# EasyEDA Pro project PCB.epro

# Schematic Schematic1_1
Board Name: Board1; Create Date: 2026-04-23; Page Name: P1; Project Name: USB Hub; Schematic Name: Schematic1; Update Date: 2026-04-30; Company: EasyEDA.com; Page Size: A4; Version: V1.0
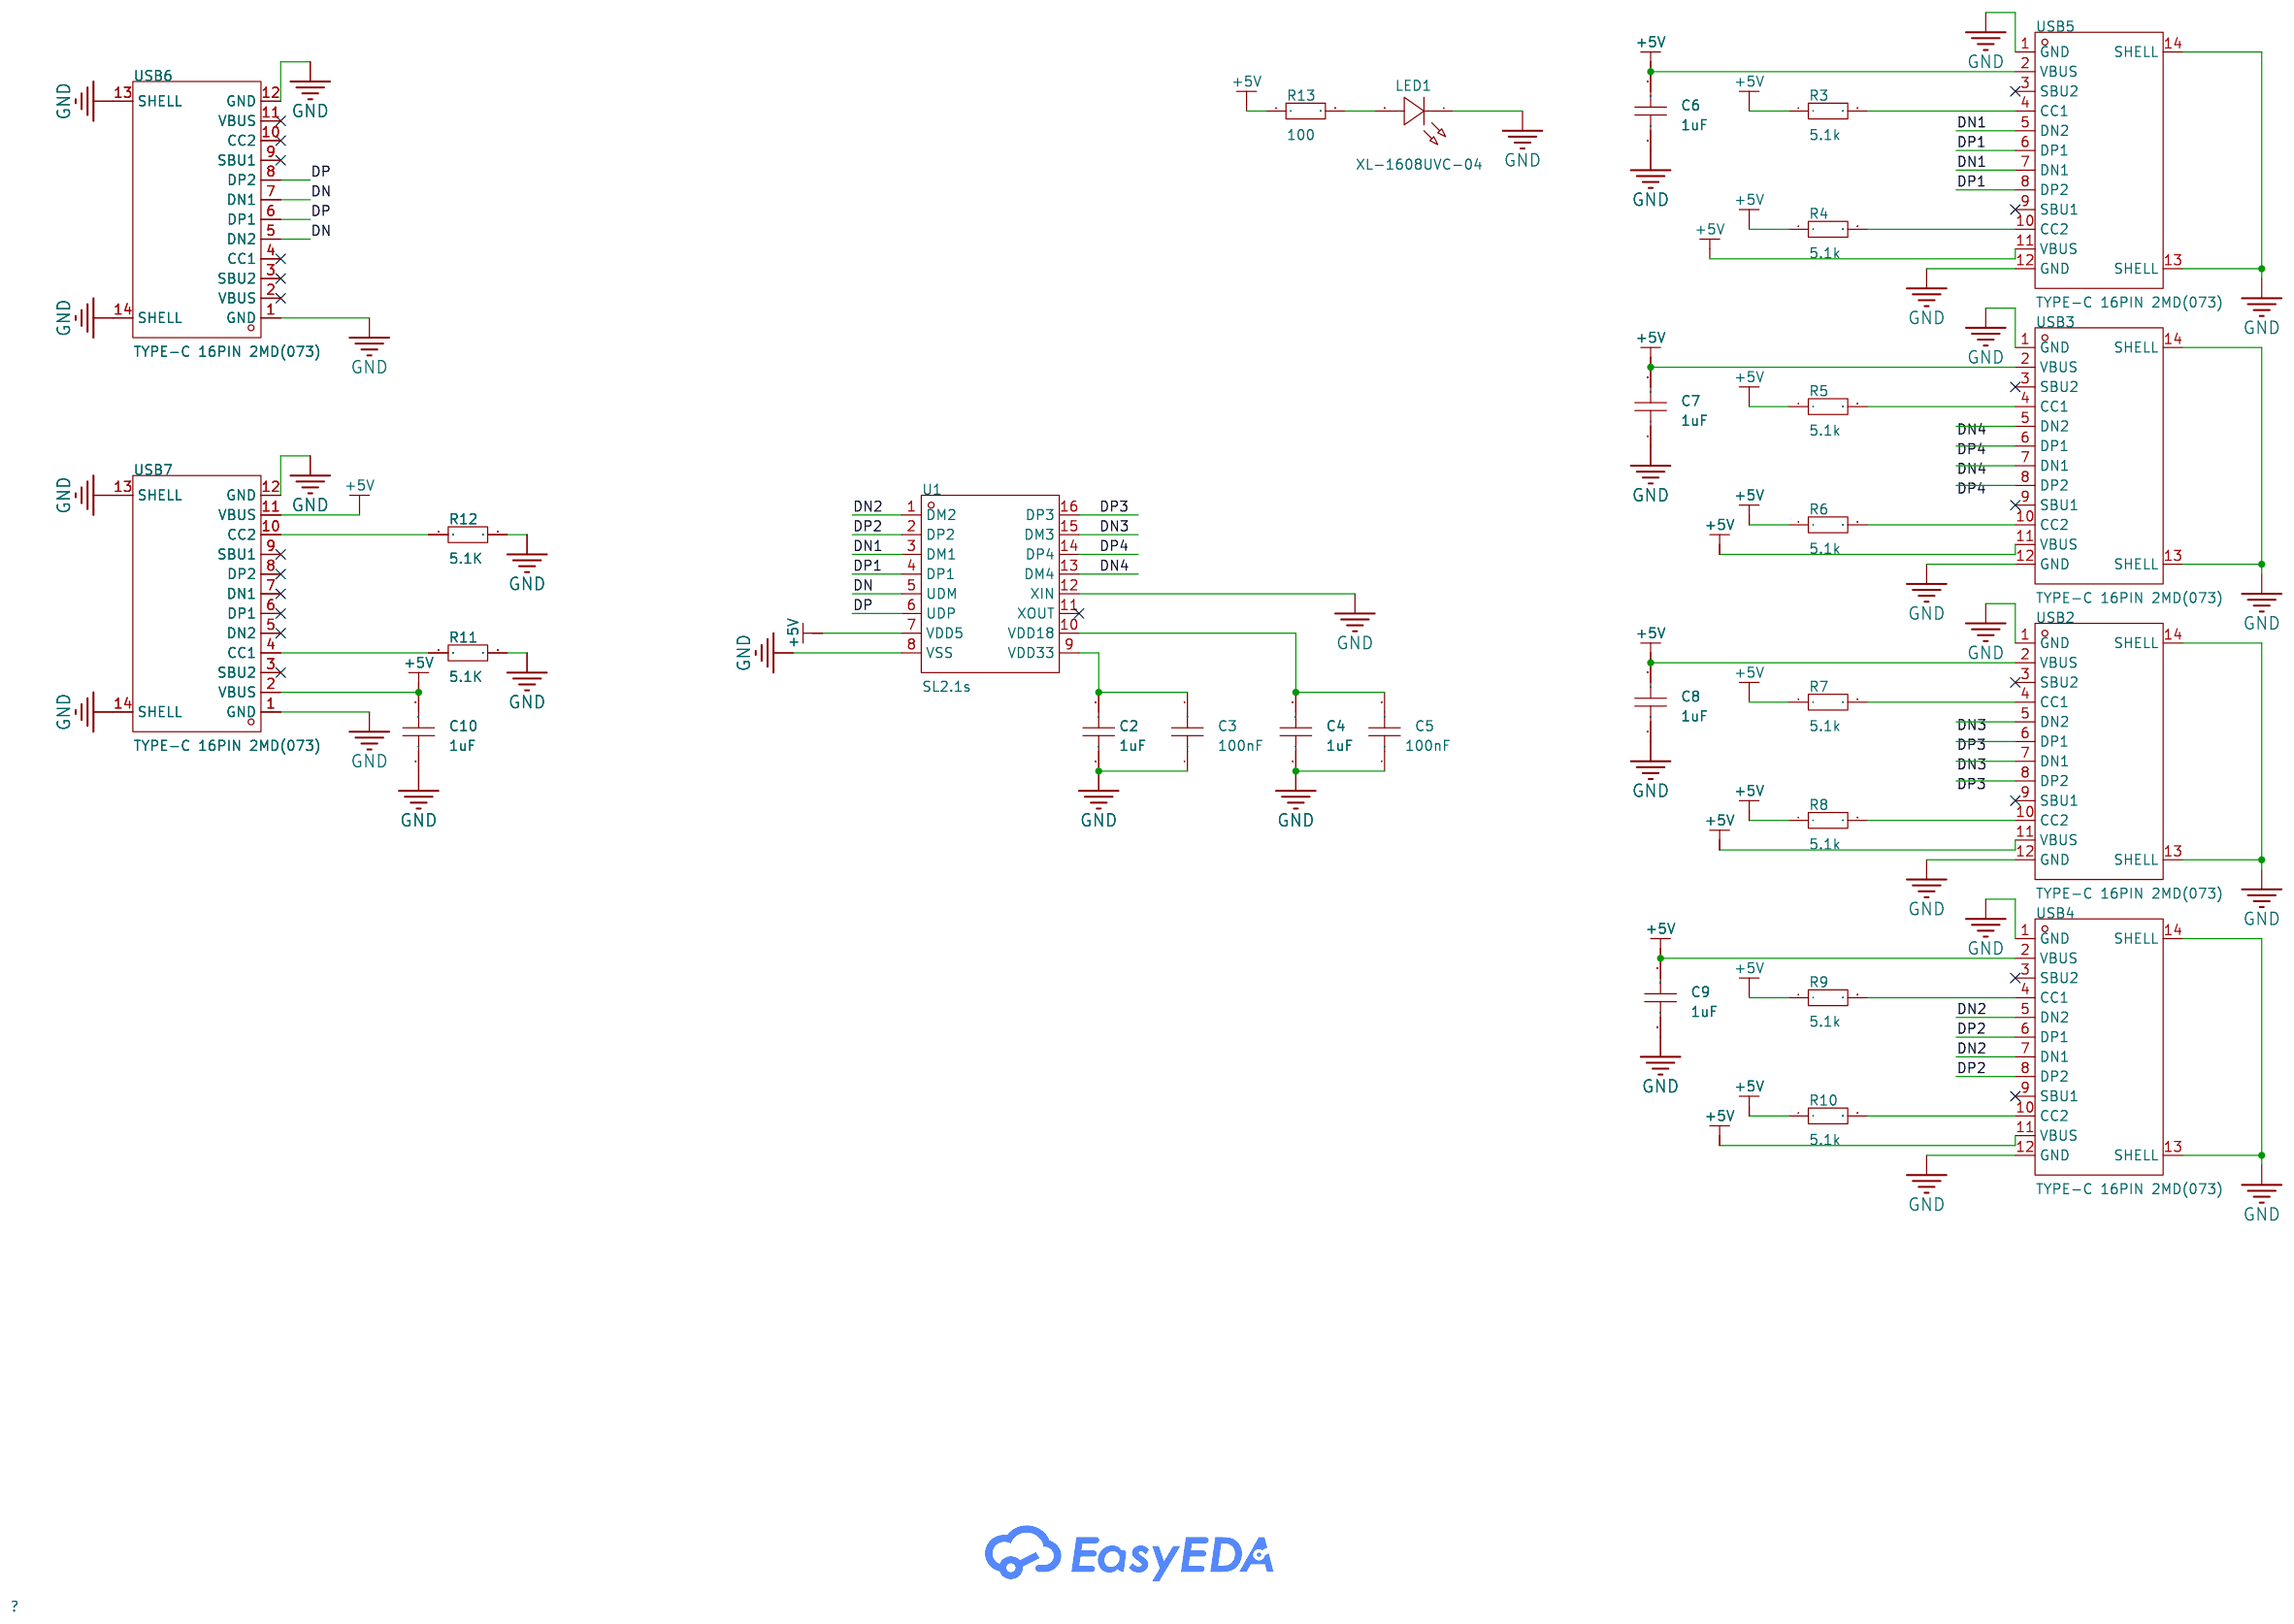
[diagram p0: schematic sheet]

## Parts
C2  1uF  [C0603]
C3  100nF  [C0603]
C4  1uF  [C0603]
C5  100nF  [C0603]
C6  1uF  [C0603]
C7  1uF  [C0603]
C8  1uF  [C0603]
C9  1uF  [C0603]
C10  1uF  [C0603]
LED1  XL-1608UVC-04  [LED0603-RD_PINK]
R3  5.1k  [R0603]
R4  5.1k  [R0603]
R5  5.1k  [R0603]
R6  5.1k  [R0603]
R7  5.1k  [R0603]
R8  5.1k  [R0603]
R9  5.1k  [R0603]
R10  5.1k  [R0603]
R11  10K  [R0603]
R12  10K  [R0603]
R13  100  [R0603]
U1  SL2.1s  [SSOP-16_L4.6-W2.6-P0.53-LS4.0-BL]
USB2  TYPE-C 16PIN 2MD(073)  [USB-C-SMD_TYPE-C-6PIN-2MD-073]
USB3  TYPE-C 16PIN 2MD(073)  [USB-C-SMD_TYPE-C-6PIN-2MD-073]
USB4  TYPE-C 16PIN 2MD(073)  [USB-C-SMD_TYPE-C-6PIN-2MD-073]
USB5  TYPE-C 16PIN 2MD(073)  [USB-C-SMD_TYPE-C-6PIN-2MD-073]
USB6  TYPE-C 16PIN 2MD(073)  [USB-C-SMD_TYPE-C-6PIN-2MD-073]
USB7  TYPE-C 16PIN 2MD(073)  [USB-C-SMD_TYPE-C-6PIN-2MD-073]

## Library data of the parts
C2-C10 = CAP_0603: Supplier Footprint: 0603
LED1 = XL-1608UVC-04: Lamp Holder Type:- Illumination Color:Purple Voltage - Forward(Vf):3.4V Voltage - Forward(Vf):3.4V Power(Watts):100mW Forward Current:5mA Wavelength - Dominant:390nm~429nm Wavelength - Dominant:390nm~429nm Peak Wavelength:405nm Diode Configuration:Discret; LCSC Part Name: 紫色; Supplier Part: C7371898; Manufacturer: XINGLIGHT(成兴光); Supplier Footprint: 0603; JLCPCB Part Class: Extended Part; Datasheet: https://item.szlcsc.com/datasheet/XL-1608UVC-04/8342970.html; Supplier: LCSC; Illumination Color: Purple; Voltage - Forward(Vf): 3.4V; Power(Watts): 100mW; Forward Current: 5mA; Wavelength - Dominant: 390nm~429nm; Peak Wavelength: 405nm; Diode Configuration: Discrete Diode; Lens Color: Water Clear; Luminous Intensity: 60mcd; Viewing Angle: 120°; Mounting Style: Top-mount; Operating Temperature: -40℃~+85℃
R3-R13 = Res_0603: Supplier Footprint: 0603
U1 = SL2.1s: type:Hub USB Protocol:USB 2.0 Data Rate:- Voltage - Supply:4V~5.25V Voltage - Supply:4V~5.25V Operating Temperature:0℃~+70℃ Operating Temperature:0℃~+70℃ Memory Interface:- Current - Supply:120mA Quiescent Supply Current:2.5mA Number of Channels:4; LCSC Part Name: USB2.0 HUB控制器集成电路; Supplier Part: C2684433; Manufacturer: CoreChips(和芯润德); Supplier Footprint: SSOP-16; JLCPCB Part Class: Extended Part; Datasheet: https://item.szlcsc.com/datasheet/SL2.1s/2782346.html; Supplier: LCSC; type: Hub; USB Protocol: USB 2.0; Voltage - Supply: 4V~5.25V; Operating Temperature: 0℃~+70℃; Current - Supply: 120mA; Quiescent Supply Current: 2.5mA; Number of Channels: 4
USB2-USB7 = TYPE-C 16PIN 2MD(073): Connector Type:Type-C Protocol Standard:- Gender:Female Mounting Type:Surface Mount, Right Angle Number of Contacts:16P Number of Ports:1 Current Rating-Power:3A Voltage Rating:5V Connect-Disconnect Life:10,000 Cycles Supplementary Features:- Center Heigh; LCSC Part Name: Type-C 母 卧贴; Supplier Part: C2765186; Manufacturer: SHOU HAN(首韩); Supplier Footprint: SMD; JLCPCB Part Class: Extended Part; Datasheet: https://item.szlcsc.com/datasheet/TYPE-C%252016PIN%25202MD(073)/2901843.html; Supplier: LCSC; Connector Type: Type-C; Gender: Female; Mounting Type: Surface Mount, Right Angle; Number of Contacts: 16P; Number of Ports: 1; Current Rating-Power: 3A; Voltage Rating: 5V; Connect-Disconnect Life: 10,000 Cycles; Detection color: Black; Operating Temperature: -25℃~+85℃

## Nets
+5V: C6.2 C7.2 C8.2 C9.2 C10.2 R3.1 R4.1 R5.1 R6.1 R7.1 R8.1 R9.1 R10.1 R13.1 U1.7(VDD5) USB2.2(VBUS) USB2.11(VBUS) USB3.2(VBUS) USB3.11(VBUS) USB4.2(VBUS) USB4.11(VBUS) USB5.2(VBUS) USB5.11(VBUS) USB7.2(VBUS) USB7.11(VBUS)
GND: C2.1 C3.1 C4.1 C5.1 C6.1 C7.1 C8.1 C9.1 C10.1 LED1.1(K) R11.2 R12.2 U1.8(VSS) U1.12(XIN) USB2.1(GND) USB2.12(GND) USB2.13(SHELL) USB2.14(SHELL) USB3.1(GND) USB3.12(GND) USB3.13(SHELL) USB3.14(SHELL) USB4.1(GND) USB4.12(GND) USB4.13(SHELL) USB4.14(SHELL) USB5.1(GND) USB5.12(GND) USB5.13(SHELL) USB5.14(SHELL) USB6.1(GND) USB6.12(GND) USB6.13(SHELL) USB6.14(SHELL) USB7.1(GND) USB7.12(GND) USB7.13(SHELL) USB7.14(SHELL)
DN: U1.5(UDM) USB6.5(DN2) USB6.7(DN1)
DN1: U1.3(DM1) USB5.5(DN2) USB5.7(DN1)
DN2: U1.1(DM2) USB4.5(DN2) USB4.7(DN1)
DN3: U1.15(DM3) USB2.5(DN2) USB2.7(DN1)
DN4: U1.13(DM4) USB3.5(DN2) USB3.7(DN1)
DP: U1.6(UDP) USB6.6(DP1) USB6.8(DP2)
DP1: U1.4(DP1) USB5.6(DP1) USB5.8(DP2)
DP2: U1.2(DP2) USB4.6(DP1) USB4.8(DP2)
DP3: U1.16(DP3) USB2.6(DP1) USB2.8(DP2)
DP4: U1.14(DP4) USB3.6(DP1) USB3.8(DP2)
$1N2501: R3.2 USB5.4(CC1)
$1N2505: R4.2 USB5.10(CC2)
$1N2510: R5.2 USB3.4(CC1)
$1N2521: R6.2 USB3.10(CC2)
$1N2525: R7.2 USB2.4(CC1)
$1N2530: R8.2 USB2.10(CC2)
$1N2535: R9.2 USB4.4(CC1)
$1N2540: R10.2 USB4.10(CC2)
$1N2933: C2.2 C3.2 U1.9(VDD33)
$1N2952: C4.2 C5.2 U1.10(VDD18)
$1N3496: R12.1 USB7.10(CC2)
$1N3510: R11.1 USB7.4(CC1)
$1N5105: LED1.2(A) R13.2

Not connected (* = marked no-connect by the designer): U1 11(XOUT)*; USB2 3(SBU2)* 9(SBU1)*; USB3 3(SBU2)* 9(SBU1)*; USB4 3(SBU2)* 9(SBU1)*; USB5 3(SBU2)* 9(SBU1)*; USB6 2(VBUS)* 3(SBU2)* 4(CC1)* 9(SBU1)* 10(CC2)* 11(VBUS)*; USB7 3(SBU2)* 5(DN2)* 6(DP1)* 7(DN1)* 8(DP2)* 9(SBU1)*

# Board PCB1_1
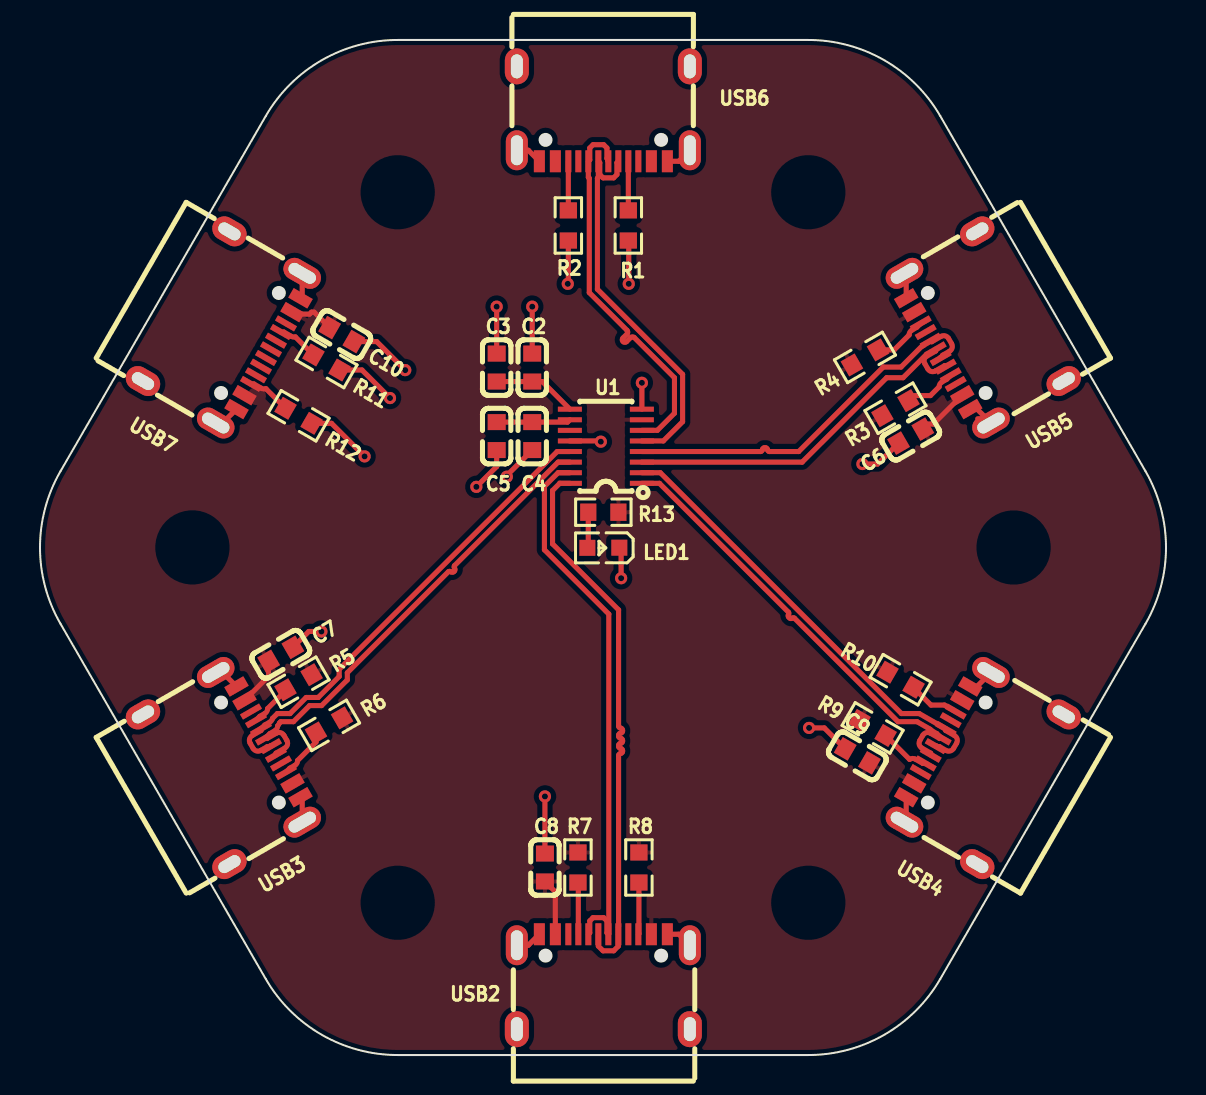
[diagram p1: board, top side]
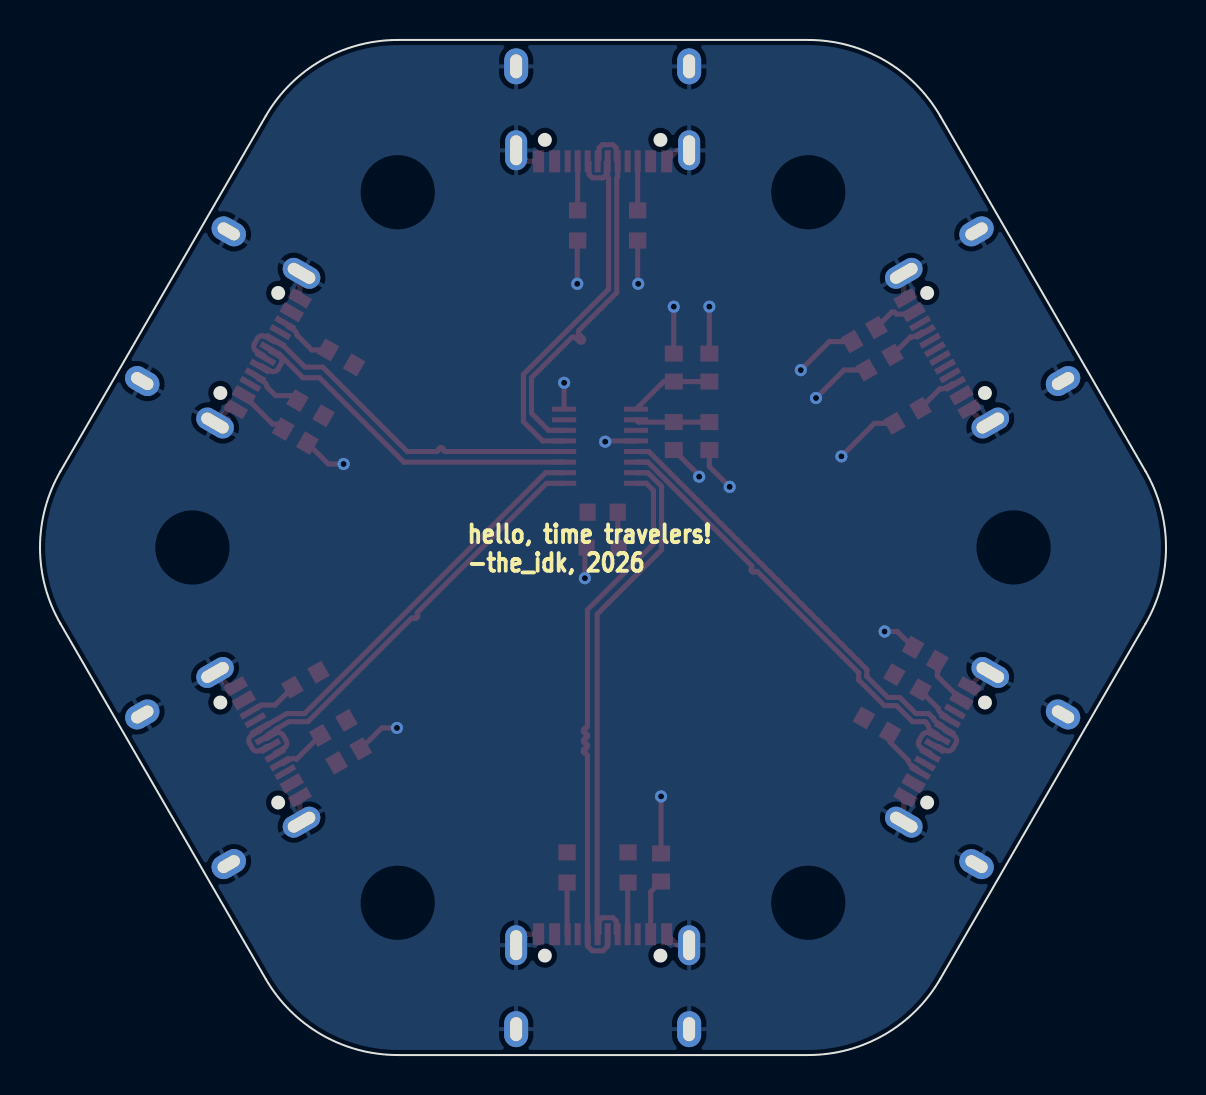
[diagram p2: board, bottom side, seen from below]

Outline 56.3 x 50.8 mm; copper layers: Top Layer, Bottom Layer. Coordinates in mm from the lower left corner of the outline.
Outline path: 1.02,21.59 arc(0,25.4) 1.02,29.21 11.29,46.99 arc(14.08,49.78) 17.89,50.8 38.42,50.8 arc(42.23,49.78) 45.02,46.99 55.28,29.21 arc(56.3,25.4) 55.28,21.59 45.02,3.81 arc(42.23,1.02) 38.42,0 17.89,0 arc(14.08,1.02) 11.29,3.81 1.02,21.59
Stack: Top Layer 0.035mm / Dielectric1 1.51mm FR4 er 4.5 / Bottom Layer 0.035mm

## Design rules (mm)
net DN2: DP2
net DP2: DP2
net DN1: DP1
net DP1: DP1
net DN: DP5
net DP: DP5
net DN4: DP3
net DP4: DP3
net DN3: DP4
net DP3: DP4
template: JLCPCB Capability(Two Layers Board)
spacing copperThickness1oz (default): track to track 0.102, other pairs 0.152 to 0.3
spacing copperThickness2oz: track to track 0.203, other pairs 0.152 to 0.3
track width copperThickness1oz (default): min 0.127, default 0.254, max 2.54
track width copperThickness2oz: min 0.203, default 0.254, max 2.54
differential pair differentialPair (default): width min 0.127, default 0.254, max 2.54; gap min 0.152, default 0.152
via viaSize (default): diameter min 0.5, default 0.61, max 10; hole min 0.3, default 0.305, max 6.3

## Placement (name value [footprint] x y rotation side)
C2  1uF  [C0603]  24.61 34.4 270 top
C3  100nF  [C0603]  22.83 34.4 270 top
C4  1uF  [C0603]  24.61 30.98 90 top
C5  100nF  [C0603]  22.83 30.98 90 top
C6  1uF  [C0603]  43.53 30.98 30 top
C7  1uF  [C0603]  12.04 20.05 210 top
C8  1uF  [C0603]  25.25 9.39 270 top
C9  1uF  [C0603]  40.87 14.97 330 top
C10  1uF  [C0603]  15.09 36.06 150 top
LED1  XL-1608UVC-04  [LED0603-RD_PINK]  28.17 25.39 180 top
R1  -  [R0603]  29.42 41.52 270 top
R2  -  [R0603]  26.42 41.52 270 top
R3  5.1k  [R0603]  42.77 32.37 30 top
R4  5.1k  [R0603]  41.25 34.91 30 top
R5  5.1k  [R0603]  12.93 18.66 210 top
R6  5.1k  [R0603]  14.45 16.5 210 top
R7  5.1k  [R0603]  26.9 9.39 270 top
R8  5.1k  [R0603]  29.95 9.39 270 top
R9  5.1k  [R0603]  41.63 16.37 330 top
R10  5.1k  [R0603]  43.03 18.78 330 top
R11  10K  [R0603]  14.32 34.66 330 top
R12  10K  [R0603]  12.93 31.99 330 top
R13  100  [R0603]  28.17 27.17 180 top
U1  SL2.1s  [SSOP-16_L4.6-W2.6-P0.53-LS4.0-BL]  28.29 30.47 90 top
USB2  TYPE-C 16PIN 2MD(073)  [USB-C-SMD_TYPE-C-6PIN-2MD-073]  28.17 3.67 0 top
USB3  TYPE-C 16PIN 2MD(073)  [USB-C-SMD_TYPE-C-6PIN-2MD-073#2]  9.37 14.49 300 top
USB4  TYPE-C 16PIN 2MD(073)  [USB-C-SMD_TYPE-C-6PIN-2MD-073#3]  46.97 14.49 60 top
USB5  TYPE-C 16PIN 2MD(073)  [USB-C-SMD_TYPE-C-6PIN-2MD-073#2]  46.97 36.29 120 top
USB6  TYPE-C 16PIN 2MD(073)  [USB-C-SMD_TYPE-C-6PIN-2MD-073]  28.17 47.1 180 top
USB7  TYPE-C 16PIN 2MD(073)  [USB-C-SMD_TYPE-C-6PIN-2MD-073#3]  9.37 36.29 240 top

## Footprints (pads in the part's own frame, mm; a bottom-side part is the same pattern mirrored in y, then rotated)
C0603
  rect 0.8x0.9 smd: 1(-0.7,0) 2(0.7,0)
LED0603-RD_PINK
  rect 0.8x0.8 smd: 1(-0.799,-0.004) 2(0.799,0.004)
R0603
  rect 0.806x0.864 smd: 1(-0.753,0) 2(0.753,0)
SSOP-16_L4.6-W2.6-P0.53-LS4.0-BL
  rect 0.25x1.2 smd: 1(-1.855,-1.8) 2(-1.325,-1.8) 3(-0.795,-1.8) 4(-0.265,-1.8) 5(0.265,-1.8) 6(0.795,-1.8) 7(1.325,-1.8) 8(1.855,-1.8) 9(1.855,1.8) 10(1.325,1.8) 11(0.795,1.8) 12(0.265,1.8) 13(-0.265,1.8) 14(-0.795,1.8) 15(-1.325,1.8) 16(-1.855,1.8)
USB-C-SMD_TYPE-C-6PIN-2MD-073
  rect 0.55x1.1 smd: 1(-3.2,2.375) 2(-2.4,2.375) 11(2.4,2.375) 12(3.2,2.375)
  rect 0.3x1.1 smd: 3(-1.75,2.375) 4(-1.25,2.375) 5(-0.75,2.375) 6(-0.25,2.375) 7(0.25,2.375) 8(0.75,2.375) 9(1.25,2.375) 10(1.75,2.375)
  oval 1.1x2 hole 0.6x1.5: 13(-4.325,1.825) 14(4.325,1.825)
  oval 1.2x1.8 hole 0.6x1.2: 13(-4.325,-2.375) 14(4.325,-2.375)
USB-C-SMD_TYPE-C-6PIN-2MD-073#2
  rect 0.55x1.1 smd: 1(-3.2,2.375) 2(-2.4,2.375) 11(2.4,2.375) 12(3.2,2.375)
  rect 0.3x1.1 smd: 3(-1.75,2.375) 4(-1.25,2.375) 5(-0.75,2.375) 6(-0.25,2.375) 7(0.25,2.375) 8(0.75,2.375) 9(1.25,2.375) 10(1.75,2.375)
  oval 1.1x2 hole 0.6x1.5: 13(-4.325,1.825) 14(4.325,1.825)
  oval 1.2x1.8 hole 0.6x1.2: 13(-4.325,-2.375) 14(4.325,-2.375)
USB-C-SMD_TYPE-C-6PIN-2MD-073#3
  rect 0.55x1.1 smd: 1(-3.2,2.375) 2(-2.4,2.375) 11(2.4,2.375) 12(3.2,2.375)
  rect 0.3x1.1 smd: 3(-1.75,2.375) 4(-1.25,2.375) 5(-0.75,2.375) 6(-0.25,2.375) 7(0.25,2.375) 8(0.75,2.375) 9(1.25,2.375) 10(1.75,2.375)
  oval 1.1x2 hole 0.6x1.5: 13(-4.325,1.825) 14(4.325,1.825)
  oval 1.2x1.8 hole 0.6x1.2: 13(-4.325,-2.375) 14(4.325,-2.375)

## Nets
As in the schematic, except:
GND: C2.1 C3.1 C4.1 C5.1 C6.1 C7.1 C8.1 C9.1 C10.1 LED1.1 R1.2 R2.2 R11.2 R12.2 U1.8 U1.12 USB2.1 USB2.12 USB2.13 USB2.14 USB3.1 USB3.12 USB3.13 USB3.14 USB4.1 USB4.12 USB4.13 USB4.14 USB5.1 USB5.12 USB5.13 USB5.14 USB6.1 USB6.12 USB6.13 USB6.14 USB7.1 USB7.12 USB7.13 USB7.14
$1N1157: R2.1 USB6.10
$1N2081: R1.1 USB6.4

Pads without a net: U1 11; USB2 3 9; USB3 3 9; USB4 3 9; USB5 3 9; USB6 2 3 9 11; USB7 3 5 6 7 8 9

## Via types
v1: diameter 0.61, hole 0.305, Top Layer to Bottom Layer, 16 vias

## Routing (per net, layer and track width the routed paths; a pad name or vN(x,y) marks a point on that pad's centre or on a via; arc(x,y) is an arc through that point)
+5V: length 9.9
  Top Layer w0.254: USB5.2 44.67,31.58 44.39,31.58 ; USB3.2 11.43,18.96 C7.2 ; C10.2 13.71,37.18 13.58,37.18 13.48,37.08 12.85,37.08 12.75,37.18 12.62,37.18 ; USB2.2 25.77,8.16 C8.2
GND: length 52.9
  Top Layer w0.254: USB2.12 31.94,6.05 USB2.14 ; C3.1 v1(22.83,37.45) ; C2.1 v1(24.61,37.45) ; U1.8 v1(30.09,33.64) ; USB4.1 43.31,11.74 43.22,11.65 ; v1(28.04,30.7) 28,30.73 U1.12 ; v1(29.06,23.86) 29.06,25.3 LED1.1 ; 13.11,39.12 13.11,37.96 USB7.1 ; 47.5,31.57 47.23,31.84 46.89,31.84 ; v1(14.07,21.2) 13.44,21.2 12.64,20.4 ; USB3.12 13.11,12.82 13.11,11.65 ; USB6.1 31.94,44.73 USB6.13 ; USB5.13 46.85,32.33 46.51,32.33 ; USB4.14 46.85,18.45 46.51,18.45 ; C9.1 39.21,16.37 v1(38.45,16.37) ; R2.2 26.42,38.62 v1(26.39,38.6) ; C5.1 22.83,29.45 v1(21.82,28.44) ; USB6.12 24.42,45.28 USB6.14 ; v1(17.5,32.88) 16.1,34.28 R11.2 ; 9.82,32.33 9.13,31.63 USB7.14 ; C8.1 v1(25.25,12.94) ; USB2.1 24.42,5.5 USB2.13 ; R12.2 14.57,31.61 v1(16.23,29.96) ; USB5.12 43.31,39.03 43.22,39.12 ; USB3.13 9.13,19.15 9.82,18.45 ; C6.1 41.88,29.58 v1(41.12,29.58) ; v1(18.26,34.28) 16.83,35.71 15.69,35.71 ; v1(29.44,38.6) 29.44,40.74 R1.2 ; C4.1 23.34,29.01 v1(23.34,28.94)
DN: length 19.6
  Top Layer w0.254: U1.5 31.17,30.73 32.13,31.7 32.13,34.06 27.87,38.32 27.87,43.88 27.92,43.93 USB6.7 27.99,44.66 27.99,44.06 28.15,43.9 28.68,43.9 28.85,44.06 28.85,44.66 USB6.5
DN1: length 18.9
  Top Layer w0.254: 45.29,34.45 45.23,34.5 44.77,34.24 arc(44.56,34.21) 44.39,34.34 44.24,34.6 arc(44.22,34.81) 44.35,34.98 44.79,35.23 44.79,35.32 ; 44.42,35.07 44.32,35.07 43.15,33.9 42.33,33.9 38.11,29.67 U1.3
DN2: length 22.7
  Top Layer w0.254: U1.1 30.97,28.61 37.43,22.16 arc(37.45,22.1) 37.43,22.04 arc(37.4,21.99) 37.43,21.93 37.49,21.86 arc(37.55,21.84) 37.61,21.86 arc(37.66,21.89) 37.72,21.86 42.9,16.68 43.85,16.68 44.51,16.3 arc(44.55,16.26) 44.6,16.23 44.84,16.08 USB4.7 44.98,15.84 44.52,16.1 arc(44.31,16.13) 44.14,16 43.99,15.74 arc(43.97,15.53) 44.1,15.36 44.54,15.11 USB4.5
DN3: length 27.7
  Top Layer w0.254: U1.15 25.91,29.14 25.22,28.46 25.22,25.29 28.44,22.07 28.44,6.07 USB2.7 28.35,6.12 28.35,6.71 28.18,6.87 27.65,6.87 27.49,6.71 27.49,6.12 USB2.5
DN4: length 23.8
  Top Layer w0.254: 11.55,15.46 11.53,15.48 arc(11.45,15.45) 11.36,15.43 11.04,15.24 arc(10.83,15.22) 10.66,15.35 10.51,15.61 arc(10.48,15.82) 10.61,15.99 11.05,16.24 11.05,16.32 11.24,16.52 11.49,16.66 arc(11.58,16.74) 11.62,16.84 11.87,17.09 12.5,17.09 13.31,17.89 13.91,17.89 14.96,18.94 14.96,19.3 25.86,30.2 U1.13
DP: length 19.6
  Top Layer w0.254: U1.6 30.87,31.26 31.72,32.12 31.72,33.9 29.71,35.91 arc(29.62,35.94) 29.53,35.91 29.33,35.71 arc(29.15,35.71) 29.15,35.89 29.35,36.09 arc(29.39,36.18) 29.35,36.27 27.46,38.16 27.46,43.88 27.42,43.93 USB6.8 27.49,44.8 27.49,45.39 27.65,45.56 28.18,45.56 28.35,45.39 28.35,44.87 28.4,44.83 28.4,44.75 USB6.6
DP1: length 18.8
  Top Layer w0.254: U1.4 36.03,30.2 arc(36.1,30.23) 36.12,30.3 arc(36.15,30.36) 36.21,30.39 36.28,30.39 arc(36.35,30.36) 36.38,30.3 arc(36.4,30.23) 36.47,30.2 37.94,30.2 42.16,34.43 43.05,34.43 44.12,35.5 44.17,35.5 ; USB5.8 44.59,35.7 45.05,35.96 arc(45.26,35.99) 45.43,35.86 45.58,35.6 arc(45.61,35.39) 45.48,35.22 45.13,35.02 arc(45.09,34.96) 45.04,34.91 USB5.6
DP2: length 22.7
  Top Layer w0.254: 44.79,15.46 44.8,15.48 arc(44.89,15.45) 44.97,15.43 45.3,15.24 arc(45.51,15.22) 45.68,15.35 45.83,15.61 arc(45.86,15.82) 45.73,15.99 45.29,16.24 45.29,16.32 43.96,17.09 43.07,17.09 31.02,29.14 U1.2
DP3: length 27.7
  Top Layer w0.254: USB2.6 27.92,5.45 28.15,5.22 28.68,5.22 28.92,5.45 USB2.8 28.92,6.4 28.93,6.42 28.93,14.99 arc(28.96,15.06) 29.03,15.09 arc(29.1,15.12) 29.13,15.19 29.13,15.25 arc(29.1,15.32) 29.03,15.35 arc(28.96,15.37) 28.93,15.45 28.93,15.5 arc(28.96,15.57) 29.03,15.6 arc(29.1,15.63) 29.13,15.7 29.13,15.75 arc(29.1,15.82) 29.03,15.85 arc(28.96,15.88) 28.93,15.95 28.93,16.01 arc(28.96,16.08) 29.03,16.11 arc(29.1,16.14) 29.13,16.21 29.13,16.26 arc(29.1,16.33) 29.03,16.36 arc(28.96,16.39) 28.93,16.46 28.93,22.28 25.63,25.58 25.63,28.25 25.99,28.61 U1.16
DP4: length 23.8
  Top Layer w0.254: USB3.8 11.8,15.11 12.24,15.36 arc(12.37,15.53) 12.34,15.74 12.19,16 arc(12.02,16.13) 11.81,16.1 11.35,15.84 USB3.6 11.49,16.08 11.74,16.23 arc(11.84,16.33) 11.88,16.47 arc(11.93,16.54) 11.98,16.62 12.04,16.68 12.67,16.68 13.48,17.49 14.08,17.49 15.37,18.77 15.37,19.13 20.42,24.18 arc(20.48,24.21) 20.55,24.18 arc(20.61,24.16) 20.68,24.18 20.73,24.23 arc(20.75,24.3) 20.73,24.36 arc(20.7,24.43) 20.73,24.5 25.9,29.67 U1.14
$1N1157: length 2.5
  Top Layer w0.254: USB6.10 R2.1
$1N2081: length 2.5
  Top Layer w0.254: USB6.4 R1.1
$1N2501: length 2.3
  Top Layer w0.254: USB5.4 45.34,33.82 45.1,33.68 arc(44.99,33.58) 44.96,33.44 44.52,33 43.68,33
$1N2505: length 2.7
  Top Layer w0.254: USB5.10 43.84,36.42 43.6,36.28 arc(43.49,36.18) 43.46,36.04 42.71,35.29 R4.2
$1N2510: length 2.2
  Top Layer w0.254: R5.2 12.28,18.23 11.38,17.34 arc(11.34,17.2) 11.24,17.09 10.99,16.95 USB3.4
$1N2521: length 2.6
  Top Layer w0.254: USB3.10 12.49,14.35 12.74,14.5 arc(12.84,14.6) 12.88,14.74 13.8,15.66 R6.2
$1N2525: length 2.6
  Top Layer w0.254: R7.2 26.92,8.61 USB2.4
$1N2530: length 2.6
  Top Layer w0.254: USB2.10 29.95,6.07 R8.2
$1N2535: length 2.6
  Top Layer w0.254: USB4.4 44.14,14.59 43.77,14.81 arc(43.63,14.84) 43.48,14.8 R9.2
$1N2540: length 2.6
  Top Layer w0.254: USB4.10 45.23,17.51 44.55,17.51 43.68,18.38 R10.2
$1N2933: length 4.2
  Top Layer w0.254: C3.2 C2.2 25.11,33.7 U1.9
$1N2952: length 3.7
  Top Layer w0.254: C5.2 C4.2 26.38,31.68 U1.10
$1N3496: length 2.2
  Top Layer w0.254: USB7.10 10.69,33.58 11.06,33.37 arc(11.18,33.33) 11.29,33.35 R12.1
$1N3510: length 2.1
  Top Layer w0.254: R11.1 12.77,35.94 arc(12.66,35.93) 12.56,35.97 12.19,36.18 USB7.4
$1N5105: length 1.8
  Top Layer w0.254: LED1.2 27.41,25.43 R13.2

## Copper pours and planes (outline as drawn; the poured copper is in the pictures)
+5V on Top Layer: -8.66,58.15 70.08,58.15 70.08,-13.47 -8.66,-13.47
GND on Bottom Layer: -14.63,60.95 74.4,60.95 74.4,-18.05 -14.63,-18.05

## Text on the board
Bottom Silkscreen Layer: hello, time travelers! / -the_idk, 2026
